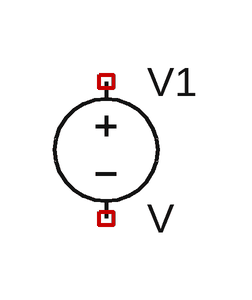
[diagram p0: schematic buck_converter_64V_5V.asc]
buck_converter_64V_5V.asc, the LTspice schematic file:
Version 4.1
SHEET 1 880 680
SYMBOL voltage 16 96 R0
SYMATTR InstName V1

The netlist it stands for:
* buck_converter_64V_5V.asc
V1 NC_01 NC_02 V
.backanno
.end